# EAGLE design coproDeadEnd (EAGLE 8.4.1)
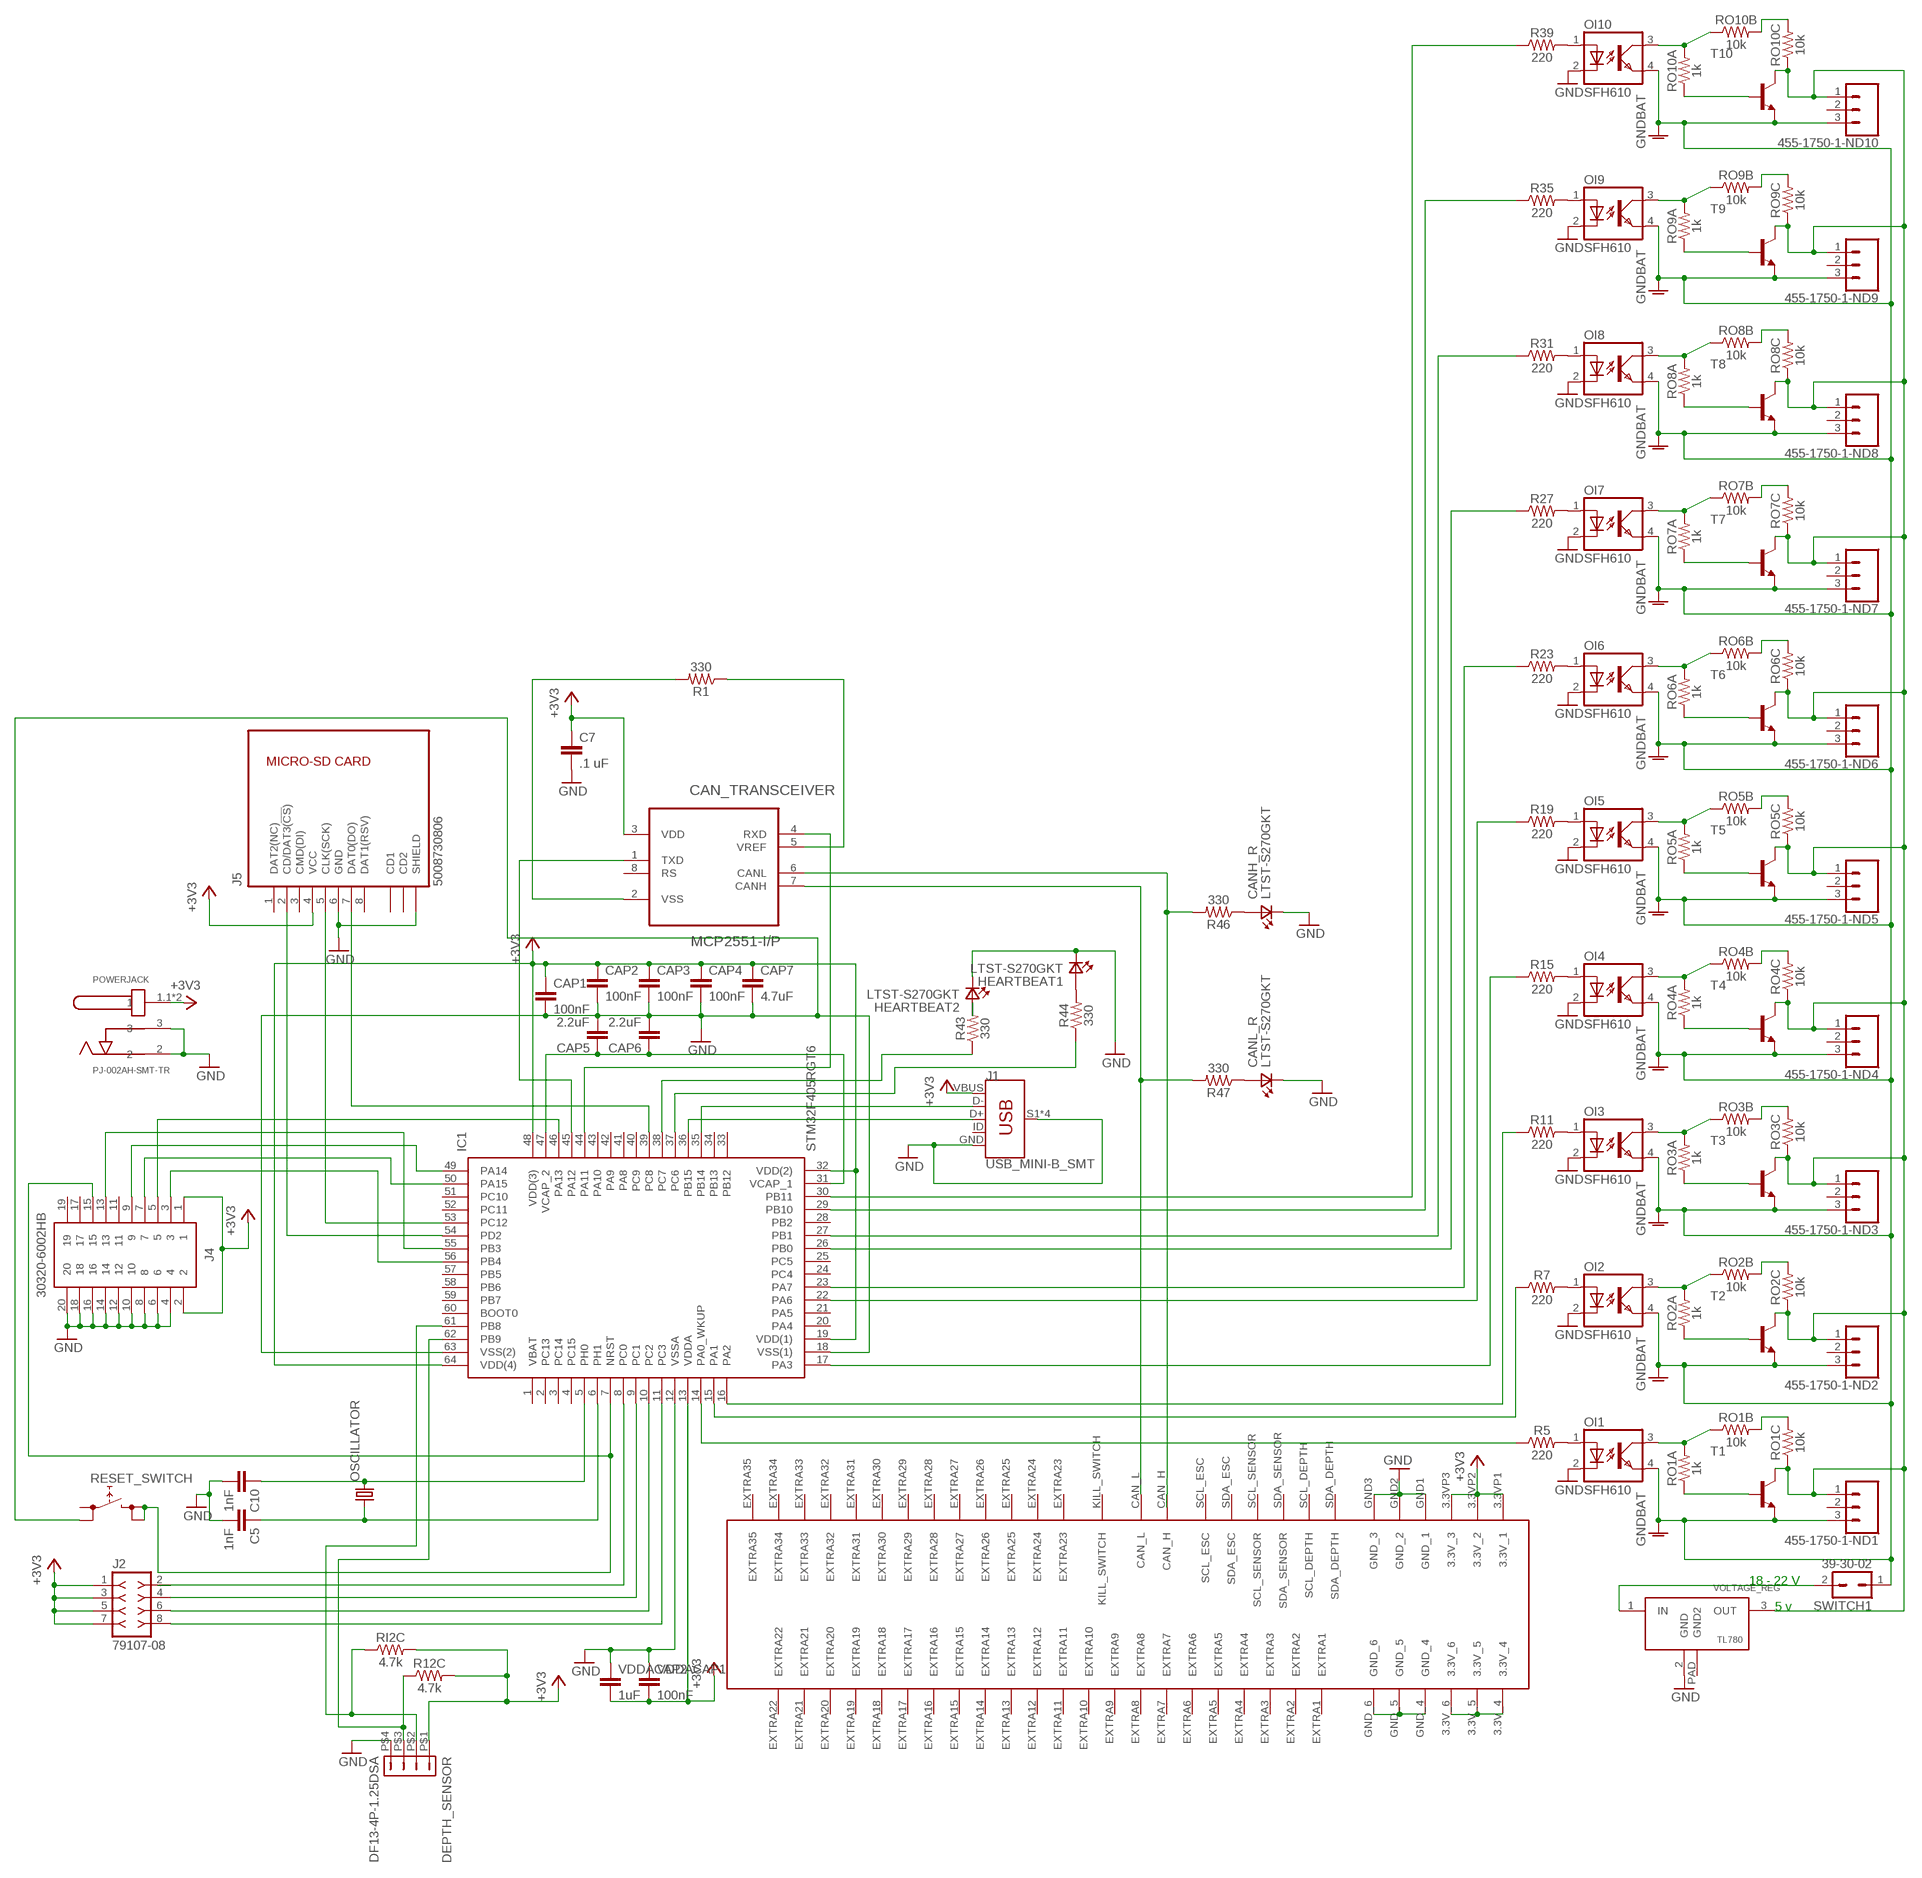
[diagram p0: schematic, sheet 1]

## Parts
455-1750-1-ND1  CONN_03  [1X03]
455-1750-1-ND2  CONN_03  [1X03]
455-1750-1-ND3  CONN_03  [1X03]
455-1750-1-ND4  CONN_03  [1X03]
455-1750-1-ND5  CONN_03  [1X03]
455-1750-1-ND6  CONN_03  [1X03]
455-1750-1-ND7  CONN_03  [1X03]
455-1750-1-ND8  CONN_03  [1X03]
455-1750-1-ND9  CONN_03  [1X03]
455-1750-1-ND10  CONN_03  [1X03]
C5  1nF  0.1UF-0603-100V-10%  [0603]
C7  .1 uF  0.1UF-0603-100V-10%  [0603]
C10  1nF  0.1UF-0603-100V-10%  [0603]
CAN_TRANSCEIVER  MCP2551-I/P  [DIP254P762X432-8]
CANH_R  LTST-S270GKT  [0603]
CANL_R  LTST-S270GKT  [0603]
CAP1  100nF  0.1UF-0603-100V-10%  [0603]
CAP2  100nF  0.1UF-0603-100V-10%  [0603]
CAP3  100nF  0.1UF-0603-100V-10%  [0603]
CAP4  100nF  0.1UF-0603-100V-10%  [0603]
CAP5  2.2uF  0.1UF-0603-100V-10%  [0603]
CAP6  2.2uF  0.1UF-0603-100V-10%  [0603]
CAP7  4.7uF  0.1UF-0603-100V-10%  [0603]
DEPTH_SENSOR  DF13-4P-1.25DSA  [DF13-4P-1.25DSA]
HEARTBEAT1  LTST-S270GKT  [0603]
HEARTBEAT2  LTST-S270GKT  [0603]
IC1  STM32F405RGT6  [QFP50P1200X1200X160-64N]
J1  USB_MINI-B_SMT  [USB-MINIB]
J2  79107-08  [79107-08]
J4  30320-6002HB  [SHDR20W81P254_2X10_3300X840X93]
J5  5008730806  [5008730806]
OI1  SFH610  [DIL04]
OI2  SFH610  [DIL04]
OI3  SFH610  [DIL04]
OI4  SFH610  [DIL04]
OI5  SFH610  [DIL04]
OI6  SFH610  [DIL04]
OI7  SFH610  [DIL04]
OI8  SFH610  [DIL04]
OI9  SFH610  [DIL04]
OI10  SFH610  [DIL04]
OSCILLATOR  CRYSTALHC49S  [HC49/S]
POWERJACK  PJ-002AH-SMT-TR  [CUI_PJ-002AH-SMT-TR]
R1  330  1KOHM-0603-1/10W-1%  [0603]
R5  220  1KOHM-0603-1/10W-1%  [0603]
R7  220  1KOHM-0603-1/10W-1%  [0603]
R11  220  1KOHM-0603-1/10W-1%  [0603]
R12C  4.7k  1KOHM-0603-1/10W-1%  [0603]
R15  220  1KOHM-0603-1/10W-1%  [0603]
R19  220  1KOHM-0603-1/10W-1%  [0603]
R23  220  1KOHM-0603-1/10W-1%  [0603]
R27  220  1KOHM-0603-1/10W-1%  [0603]
R31  220  1KOHM-0603-1/10W-1%  [0603]
R35  220  1KOHM-0603-1/10W-1%  [0603]
R39  220  1KOHM-0603-1/10W-1%  [0603]
R43  330  1KOHM-0603-1/10W-1%  [0603]
R44  330  1KOHM-0603-1/10W-1%  [0603]
R46  330  1KOHM-0603-1/10W-1%  [0603]
R47  330  1KOHM-0603-1/10W-1%  [0603]
RESET_SWITCH  REKN  [REKN]
RI2C  4.7k  1KOHM-0603-1/10W-1%  [0603]
RO1A  1k  1KOHM-0603-1/10W-1%  [0603]
RO1B  10k  1KOHM-0603-1/10W-1%  [0603]
RO1C  10k  1KOHM-0603-1/10W-1%  [0603]
RO2A  1k  1KOHM-0603-1/10W-1%  [0603]
RO2B  10k  1KOHM-0603-1/10W-1%  [0603]
RO2C  10k  1KOHM-0603-1/10W-1%  [0603]
RO3A  1k  1KOHM-0603-1/10W-1%  [0603]
RO3B  10k  1KOHM-0603-1/10W-1%  [0603]
RO3C  10k  1KOHM-0603-1/10W-1%  [0603]
RO4A  1k  1KOHM-0603-1/10W-1%  [0603]
RO4B  10k  1KOHM-0603-1/10W-1%  [0603]
RO4C  10k  1KOHM-0603-1/10W-1%  [0603]
RO5A  1k  1KOHM-0603-1/10W-1%  [0603]
RO5B  10k  1KOHM-0603-1/10W-1%  [0603]
RO5C  10k  1KOHM-0603-1/10W-1%  [0603]
RO6A  1k  1KOHM-0603-1/10W-1%  [0603]
RO6B  10k  1KOHM-0603-1/10W-1%  [0603]
RO6C  10k  1KOHM-0603-1/10W-1%  [0603]
RO7A  1k  1KOHM-0603-1/10W-1%  [0603]
RO7B  10k  1KOHM-0603-1/10W-1%  [0603]
RO7C  10k  1KOHM-0603-1/10W-1%  [0603]
RO8A  1k  1KOHM-0603-1/10W-1%  [0603]
RO8B  10k  1KOHM-0603-1/10W-1%  [0603]
RO8C  10k  1KOHM-0603-1/10W-1%  [0603]
RO9A  1k  1KOHM-0603-1/10W-1%  [0603]
RO9B  10k  1KOHM-0603-1/10W-1%  [0603]
RO9C  10k  1KOHM-0603-1/10W-1%  [0603]
RO10A  1k  1KOHM-0603-1/10W-1%  [0603]
RO10B  10k  1KOHM-0603-1/10W-1%  [0603]
RO10C  10k  1KOHM-0603-1/10W-1%  [0603]
SWITCH1  39-30-02  [39-30-?02?]
T1  -NPN-TO126V  [TO126V]
T2  -NPN-TO126V  [TO126V]
T3  -NPN-TO126V  [TO126V]
T4  -NPN-TO126V  [TO126V]
T5  -NPN-TO126V  [TO126V]
T6  -NPN-TO126V  [TO126V]
T7  -NPN-TO126V  [TO126V]
T8  -NPN-TO126V  [TO126V]
T9  -NPN-TO126V  [TO126V]
T10  -NPN-TO126V  [TO126V]
U$1  5530843  [5530843-6-BOARDFINGERS]
VDDACAP1  100nF  0.1UF-0603-100V-10%  [0603]
VDDACAP2  1uF  0.1UF-0603-100V-10%  [0603]
VOLTAGE_REG  TL780_VREG  [D2PAK-3]

## Nets
2: IC1.8(PC0) J2.2
3.3V: C7.1 CAN_TRANSCEIVER.3(VDD) CAP1.1 CAP2.1 CAP3.1 CAP4.1 CAP7.1 DEPTH_SENSOR.P$1 IC1.13(VDDA) IC1.19(VDD(1)) IC1.32(VDD(2)) IC1.48(VDD(3)) IC1.64(VDD(4)) J1.VBUS J2.1 J2.3 J2.5 J2.7 J4.1 J4.2 J5.4(VCC) POWERJACK.1.1 POWERJACK.1.2 R12C.2 RI2C.2 U$1.3.3VP1(3.3V_1) U$1.3.3VP2(3.3V_2) U$1.3.3VP3(3.3V_3) VDDACAP1.2 VDDACAP2.2 ; supply symbol labelled +3V3
4: IC1.9(PC1) J2.4
6: IC1.10(PC2) J2.6
8: IC1.11(PC3) J2.8
CANH: CAN_TRANSCEIVER.6(CANL) R46.2 U$1.CAN_H
CANL: CAN_TRANSCEIVER.7(CANH) R47.2 U$1.CAN_L
CLK: IC1.53(PC12) J5.5(CLK(SCK))
CMD: IC1.54(PD2) J5.2(CD/DAT3(!CS!))
D+: IC1.36(PB15) J1.D+
D-: IC1.35(PB14) J1.D-
DATO: IC1.39(PC8) J5.7(DAT0(DO))
GND: C5.2 C7.2 C10.2 CANH_R.1(K2) CANL_R.1(K2) CAP1.2 CAP2.2 CAP3.2 CAP4.2 CAP5.2 CAP6.2 CAP7.2 DEPTH_SENSOR.P$4 HEARTBEAT1.1(K2) HEARTBEAT2.1(K2) IC1.12(VSSA) IC1.18(VSS(1)) IC1.63(VSS(2)) J1.GND J1.S1(SHIELD) J1.S2(SHIELD) J1.S3(SHIELD) J1.S4(SHIELD) J4.4 J4.6 J4.8 J4.10 J4.12 J4.14 J4.16 J4.18 J4.20 J5.6(GND) J5.S3(SHIELD) J5.S4(SHIELD) OI1.2(C) OI2.2(C) OI3.2(C) OI4.2(C) OI5.2(C) OI6.2(C) OI7.2(C) OI8.2(C) OI9.2(C) OI10.2(C) POWERJACK.2 POWERJACK.3 RESET_SWITCH.0B U$1.GND1(GND_1) U$1.GND2(GND_2) U$1.GND3(GND_3) U$1.GND_4 U$1.GND_5 U$1.GND_6 VDDACAP1.1 VDDACAP2.1 VOLTAGE_REG.2(GND)
GNDBAT: 455-1750-1-ND1.3 455-1750-1-ND2.3 455-1750-1-ND3.3 455-1750-1-ND4.3 455-1750-1-ND5.3 455-1750-1-ND6.3 455-1750-1-ND7.3 455-1750-1-ND8.3 455-1750-1-ND9.3 455-1750-1-ND10.3 OI1.4(EMIT) OI2.4(EMIT) OI3.4(EMIT) OI4.4(EMIT) OI5.4(EMIT) OI6.4(EMIT) OI7.4(EMIT) OI8.4(EMIT) OI9.4(EMIT) OI10.4(EMIT) SWITCH1.1 T1.1(E) T2.1(E) T3.1(E) T4.1(E) T5.1(E) T6.1(E) T7.1(E) T8.1(E) T9.1(E) T10.1(E)
HEARTBEAT1: IC1.37(PC6) R44.1
HEARTBEAT2: IC1.38(PC7) R43.1
JTAG3: IC1.56(PB4) J4.3
JTAG5: IC1.46(PA13) J4.5
JTAG9: IC1.49(PA14) J4.9
JTAG13: IC1.55(PB3) J4.13
JTAG15: IC1.7(NRST) J4.15 RESET_SWITCH.1A RESET_SWITCH.1B
N$1: OI2.3(COL) RO2A.2 RO2B.1
N$2: RO1A.1 T1.3(B)
N$4: OI1.1(A) R5.2
N$5: CAN_TRANSCEIVER.2(VSS) R1.2
N$6: OI1.3(COL) RO1A.2 RO1B.1
N$7: SWITCH1.2 VOLTAGE_REG.1(IN)
N$8: CANL_R.2(A2) R47.1
N$9: RO2A.1 T2.3(B)
N$10: RO1B.2 RO1C.2
N$11: OI2.1(A) R7.2
N$12: CAN_TRANSCEIVER.5(VREF) R1.1
N$13: IC1.14(PA0_WKUP) R5.1
N$14: HEARTBEAT2.2(A2) R43.2
N$15: RO2B.2 RO2C.2
N$16: OI3.3(COL) RO3A.2 RO3B.1
N$17: RO3A.1 T3.3(B)
N$18: 455-1750-1-ND1.1 455-1750-1-ND2.1 455-1750-1-ND3.1 455-1750-1-ND4.1 455-1750-1-ND5.1 455-1750-1-ND6.1 455-1750-1-ND7.1 455-1750-1-ND8.1 455-1750-1-ND9.1 455-1750-1-ND10.1 RO1C.1 RO2C.1 RO3C.1 RO4C.1 RO5C.1 RO6C.1 RO7C.1 RO8C.1 RO9C.1 RO10C.1 T1.2(C) T2.2(C) T3.2(C) T4.2(C) T5.2(C) T6.2(C) T7.2(C) T8.2(C) T9.2(C) T10.2(C) VOLTAGE_REG.3(OUT)
N$19: OI3.1(A) R11.2
N$22: RO3B.2 RO3C.2
N$23: OI4.3(COL) RO4A.2 RO4B.1
N$24: RO4A.1 T4.3(B)
N$26: OI4.1(A) R15.2
N$28: HEARTBEAT1.2(A2) R44.2
N$29: RO4B.2 RO4C.2
N$30: OI5.3(COL) RO5A.2 RO5B.1
N$31: RO5A.1 T5.3(B)
N$33: OI5.1(A) R19.2
N$34: CANH_R.2(A2) R46.1
N$36: RO5B.2 RO5C.2
N$37: OI6.3(COL) RO6A.2 RO6B.1
N$38: RO6A.1 T6.3(B)
N$40: OI6.1(A) R23.2
N$43: RO6B.2 RO6C.2
N$44: OI7.3(COL) RO7A.2 RO7B.1
N$45: RO7A.1 T7.3(B)
N$47: OI7.1(A) R27.2
N$50: RO7B.2 RO7C.2
N$51: OI8.3(COL) RO8A.2 RO8B.1
N$52: RO8A.1 T8.3(B)
N$54: OI8.1(A) R31.2
N$57: RO8B.2 RO8C.2
N$58: OI9.3(COL) RO9A.2 RO9B.1
N$59: RO9A.1 T9.3(B)
N$61: OI9.1(A) R35.2
N$64: RO9B.2 RO9C.2
N$65: OI10.3(COL) RO10A.2 RO10B.1
N$66: RO10A.1 T10.3(B)
N$68: OI10.1(A) R39.2
N$71: RO10B.2 RO10C.2
OI2: IC1.15(PA1) R7.1
OI3: IC1.16(PA2) R11.1
OI4: IC1.17(PA3) R15.1
OI5: IC1.22(PA6) R19.1
OI6: IC1.23(PA7) R23.1
OI7: IC1.26(PB0) R27.1
OI8: IC1.27(PB1) R31.1
OI10: IC1.30(PB11) R39.1
OIO9: IC1.29(PB10) R35.1
OSC1: C5.1 IC1.6(PH1) OSCILLATOR.1
OSC2: C10.1 IC1.5(PH0) OSCILLATOR.2
P$2: DEPTH_SENSOR.P$2 IC1.61(PB8) RI2C.1
PA15: IC1.50(PA15) J4.7
POWER: U$1.3.3V_4 U$1.3.3V_5 U$1.3.3V_6
PS$3: DEPTH_SENSOR.P$3 IC1.62(PB9) R12C.1
RXD: CAN_TRANSCEIVER.4(RXD) IC1.44(PA11)
TXD: CAN_TRANSCEIVER.1(TXD) IC1.45(PA12)
VCAP_2TO1: CAP5.1 CAP6.1 IC1.31(VCAP_1) IC1.47(VCAP_2)
Unconnected: 455-1750-1-ND1.2 455-1750-1-ND2.2 455-1750-1-ND3.2 455-1750-1-ND4.2 455-1750-1-ND5.2 455-1750-1-ND6.2 455-1750-1-ND7.2 455-1750-1-ND8.2 455-1750-1-ND9.2 455-1750-1-ND10.2 CAN_TRANSCEIVER.8(RS) IC1.1(VBAT) IC1.2(PC13) IC1.3(PC14) IC1.4(PC15) IC1.20(PA4) IC1.21(PA5) IC1.24(PC4) IC1.25(PC5) IC1.28(PB2) IC1.33(PB12) IC1.34(PB13) IC1.40(PC9) IC1.41(PA8) IC1.42(PA9) IC1.43(PA10) IC1.51(PC10) IC1.52(PC11) IC1.57(PB5) IC1.58(PB6) IC1.59(PB7) IC1.60(BOOT0) J1.ID J4.11 J4.17 J4.19 J5.1(DAT2(NC)) J5.3(CMD(DI)) J5.8(DAT1(RSV)) J5.CD1 J5.CD2 RESET_SWITCH.0A U$1.EXTRA1 U$1.EXTRA2 U$1.EXTRA3 U$1.EXTRA4 U$1.EXTRA5 U$1.EXTRA6 U$1.EXTRA7 U$1.EXTRA8 U$1.EXTRA9 U$1.EXTRA10 U$1.EXTRA11 U$1.EXTRA12 U$1.EXTRA13 U$1.EXTRA14 U$1.EXTRA15 U$1.EXTRA16 U$1.EXTRA17 U$1.EXTRA18 U$1.EXTRA19 U$1.EXTRA20 U$1.EXTRA21 U$1.EXTRA22 U$1.EXTRA23 U$1.EXTRA24 U$1.EXTRA25 U$1.EXTRA26 U$1.EXTRA27 U$1.EXTRA28 U$1.EXTRA29 U$1.EXTRA30 U$1.EXTRA31 U$1.EXTRA32 U$1.EXTRA33 U$1.EXTRA34 U$1.EXTRA35 U$1.KILL_SWITCH U$1.SCL_DEPTH U$1.SCL_ESC U$1.SCL_SENSOR U$1.SDA_DEPTH U$1.SDA_ESC U$1.SDA_SENSOR VOLTAGE_REG.PAD(GND2)

## Notes on the sheet
- 18 - 22 V
- 5 v

## Library data of the parts
455-1750-1-ND1-455-1750-1-ND10 = SparkFun-Connectors:CONN_03: Multi connection point. Often used as Generic Header-pin footprint for 0.1 inch spaced/style header connections On any of the 0.1 inch spaced packages, you can populate with these: Break Away Headers - Straight <https://www.sparkfun.com/products/116> (PRT-00116) Break Away Male Headers - Right Angle <https://www.sparkfun.com/products/553> (PRT-00553) Female Headers <https://www.sparkfun.com/products/115> (PRT-00115) Break Away Headers - Machine Pin <https://www.sparkfun.com/products/117> (PRT-00117) Break Away Female Headers - Swiss Machine Pin <https://www.sparkfun.com/products/743> (PRT-00743) Stackable Header - 3 Pin (Female, 0.1") <https://www.sparkfun.com/products/13875> (PRT-13875) For SCREWTERMINALS and SPRING TERMINALS visit here: Screw Terimnals on SparkFun.com <https://www.sparkfun.com/search/results?term=Screw+Terminals> (5mm/3.5mm/2.54mm spacing) This device is also useful as a general connection point to wire up your design to another part of your project. Our various solder wires solder well into these plated through hole pads. Hook-Up Wire - Assortment (Stranded, 22 AWG) <https://www.sparkfun.com/products/11375> (PRT-11375) Hook-Up Wire - Assortment (Solid Core, 22 AWG) <https://www.sparkfun.com/products/11367> (PRT-11367) View the entire wire category on our website here <https://www.sparkfun.com/categories/141> Special notes: Molex polarized connector foot print use with SKU : PRT-08232 with associated crimp pins and housings.; PROD_ID: XXX-00000; VALUE: 455-1750-1-ND
C5 C7 C10 CAP1-CAP7 VDDACAP1 VDDACAP2 = SparkFun-Capacitors:0.1UF: 0.1µF ceramic capacitors A capacitor is a passive two-terminal electrical component used to store electrical energy temporarily in an electric field.; PROD_ID: CAP-08390; VALUE: 0.1uF
CAN_TRANSCEIVER = MCP2551-I_P:MCP2551-I/P: High-Speed CAN Transceiver; DESCRIPTION: MCP2551 Series 5.5 V 1 Mb/s Surface Mount High-Speed CAN Transceiver - PDIP-8; DIGI-KEY_PART_NUMBER: MCP2551-I/P-ND; DIGI-KEY_PURCHASE_URL: https://www.digikey.com/product-detail/en/microchip-technology/MCP2551-I-P/MCP2551-I-P-ND/509453?WT.z_cid=ref_snapeda; MF: Microchip; MP: MCP2551-I/P; PACKAGE: DIP-8 Microchip
CANH_R CANL_R HEARTBEAT1 HEARTBEAT2 = LTST-S270GKT:LTST-S270GKT: https://octopart.com/ltst-c190gkt-lite-on-549821; AVAILABILITY: Good; DESCRIPTION: Green 1.6 x 0.6 x 1.15 mm 130° Water Clear 12 mcd 2.1 V Molded SMT LED; MF: Lite-On; MP: LTST-S270GKT; PACKAGE: 0603 Lite-On; PRICE: 0.08 USD
DEPTH_SENSOR = con-hirose-df13:DF13-4P-1.25: DF13-4P 1.25mm Pitch Miniature Crimping Connector.
IC1 = STM32F405RGT6:STM32F405RGT6: MCU 32-Bit, ARM Cortex M4, 1MB Flash STMicroelectronics STM32F405RGT6, 32bit ARM Cortex M4F Microcontroller, 168MHz, 1024 kB Flash, 64-Pin LQFP <https://componentsearchengine.com/Images/3/STM32F405RGT6.jpg> Source: Datasheet <http://www.st.com/web/en/resource/technical/document/datasheet/DM00037051.pdf>; ALLIED_NUMBER: 70391099; DESCRIPTION: MCU 32-Bit, ARM Cortex M4, 1MB Flash STMicroelectronics STM32F405RGT6, 32bit ARM Cortex M4F Microcontroller, 168MHz, 1024 kB Flash, 64-Pin LQFP; HEIGHT: 1.6mm; MANUFACTURER_NAME: STMicroelectronics; MANUFACTURER_PART_NUMBER: STM32F405RGT6; RS_PART_NUMBER: 7468217; SUPPLIER_NAME: RS
J1 = SparkFun-Connectors:USB_MINI-B: USB type Mini-B Connector Breaks out 5th pin, and includes shield pins if needed. SparkFun Products: SparkFun FTDI Basic Breakout <https://www.sparkfun.com/products/9716> SparkFun XBee Explorer USB <https://www.sparkfun.com/products/11812> SparkFun Redboard <https://www.sparkfun.com/products/12757>; PROD_ID: CONN-08193; SF_ID: PRT-00587
J2 = con-molex-milli-grid:79107-08: RECEPTACAL
J4 = 30320-6002HB:30320-6002HB: Header 20 position 3M 303 Series, 2.54mm Pitch 20 Way 2 Row Shrouded Straight PCB Header, Through Hole, Solder Termination <https://componentsearchengine.com/Images/3/30320-6002HB.jpg> Source: Datasheet <http://multimedia.3m.com/mws/media/22504O/3mtm-100-in-loprof-hdr-100x-100strt-ra-4-wall-ts0818.pdf>; DESCRIPTION: Header 20 position 3M 303 Series, 2.54mm Pitch 20 Way 2 Row Shrouded Straight PCB Header, Through Hole, Solder Termination; HEIGHT: 9.3mm; MANUFACTURER_NAME: 3M; MANUFACTURER_PART_NUMBER: 30320-6002HB; RS_PART_NUMBER: 8273587; SUPPLIER_NAME: RS
J5 = 5008730806:5008730806: micro SD Card Connector Molex; AVAILABILITY: Good; DESCRIPTION: Connector: for cards; SD Micro; push-push; SMT; gold plated; PIN: 8; MF: Molex; MP: 500873-0806; PACKAGE: None; PRICE: 2.47 USD
OI1-OI10 = optocoupler:SFH610: SIEMENS OPTO COUPLER; MF: VISHAY/TELEFUNKEN; MPN: SFH6106-4; OC_FARNELL: 1469568; OC_NEWARK: 58K2193
OSCILLATOR = crystal:CRYSTAL: CRYSTAL; OC_FARNELL: 1667008; OC_NEWARK: unknown
POWERJACK = PJ-002AH-SMT-TR:PJ-002AH-SMT-TR: PJ-002 Series 2 x 6.5 mm 24 V Right Angle SMT Power Jack; AVAILABILITY: Good; DESCRIPTION: 24 VDC 5 A Surface Mount Unshielded 2 Conductors 3 Contacts Male Power Jack; MF: CUI; MP: PJ-002AH-SMT-TR; PACKAGE: None; PRICE: 0.98 USD
R1 R5 R7 R11 R12C R15 R19 R23 R27 R31 R35 R39 R43 R44 R46 R47 RI2C RO1B RO1C RO2B RO2C RO3B RO3C RO4B RO4C RO5B RO5C RO6B RO6C RO7B RO7C RO8B RO8C RO9B RO9C RO10B RO10C = SparkFun-Resistors:1KOHM: 1kΩ resistor A resistor is a passive two-terminal electrical component that implements electrical resistance as a circuit element. Resistors act to reduce current flow, and, at the same time, act to lower voltage levels within circuits. - Wikipedia; PROD_ID: RES-07856; VALUE: 1k
RESET_SWITCH = switch:REKN: PUSH SWITCH ITT-Cannon-Cannon
RO1A RO2A RO3A RO4A RO5A RO6A RO7A RO8A RO9A RO10A = SparkFun-Resistors:1KOHM: 1kΩ resistor A resistor is a passive two-terminal electrical component that implements electrical resistance as a circuit element. Resistors act to reduce current flow, and, at the same time, act to lower voltage levels within circuits. - Wikipedia; PROD_ID: RES-07856
SWITCH1 = con-molex-mini-fit:39-30-?02?: HEADER
T1-T10 = transistor:*-NPN-: NPN Transistror BF959 corrected 2008.03.06
U$1 = 5530843-6:5530843
VOLTAGE_REG = TL780_VREG:TL780_VREG; AVAILABILITY: Good; DESCRIPTION: 3 Pin 1.5A Fixed 5V Positive Voltage Regulator 3-TO-220 0 to 125; MF: Texas Instruments; MP: TL780-05KCSE3; PACKAGE: TO-220 Texas Instruments; PRICE: 0.44 USD

## Board
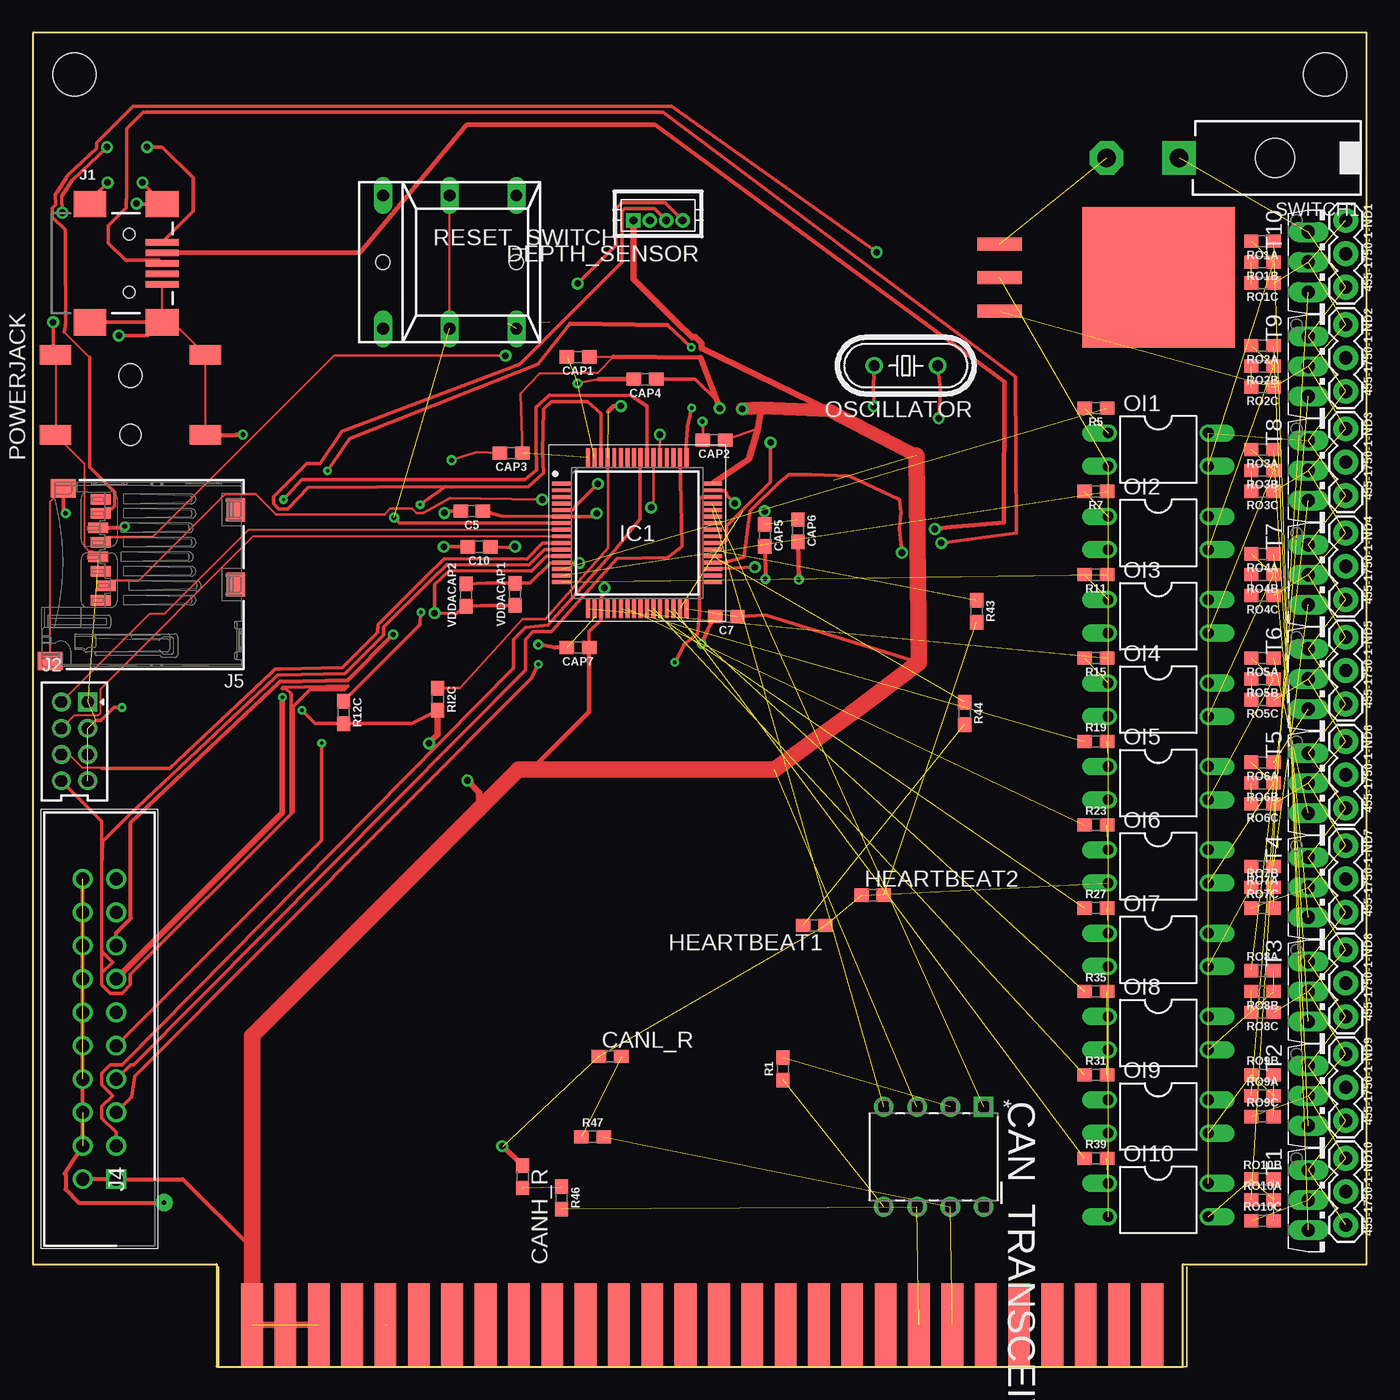
[diagram p1: board, top side]
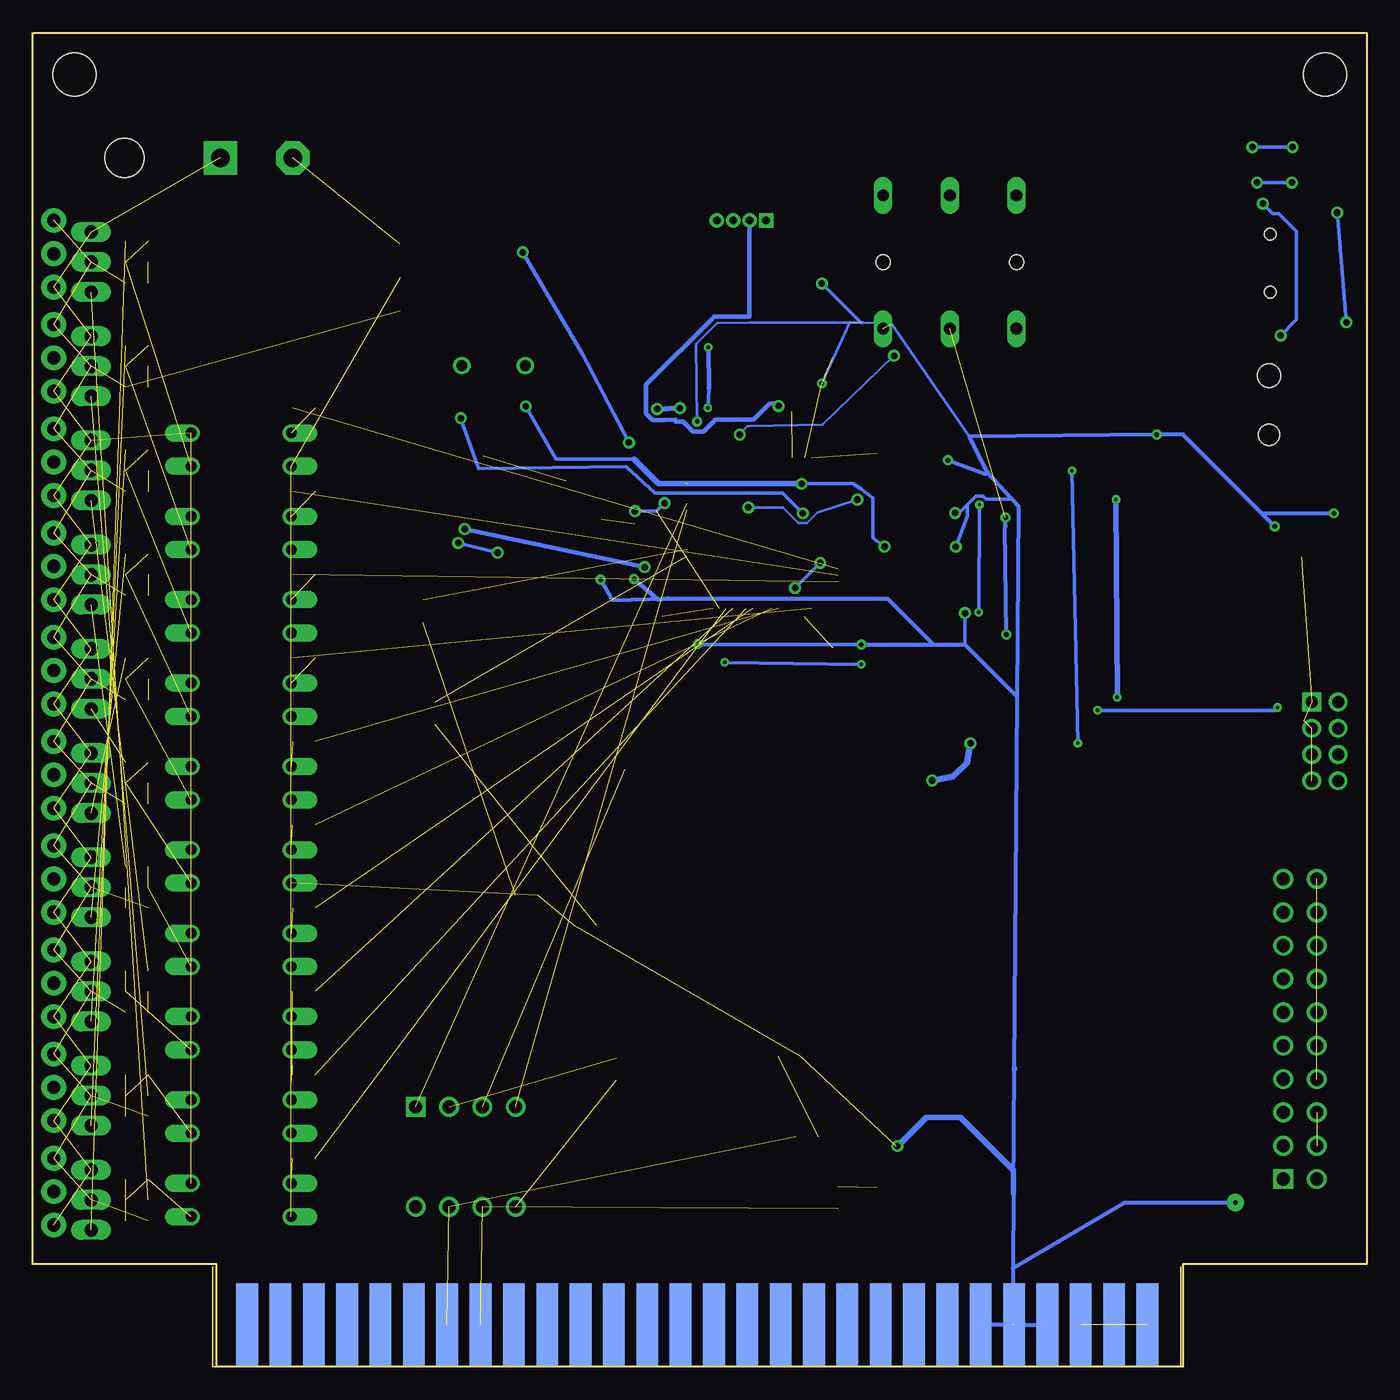
[diagram p2: board, bottom side, seen from below]

Size 101.6 x 101.6 mm. Coordinates in mm from the lower left corner, seen from the top.
Outline: 14,0 87.6,0 87.6,7.8 101.6,7.8 101.6,101.6 0,101.6 0,7.8 14,7.8 14,0
Copper layers (1*16): Top 0.035mm / dielectric 1.5mm / Bottom 0.035mm
Design rules "battery_balancer": minimum track width 6mil, minimum drill 0.35mm, track to track 0.205mm, track to pad 0.205mm, pad to pad 0.205mm, via to via 0.205mm, smd to smd 6mil, copper to edge 40mil, drill to drill 6mil, minimum pad ring 10mil, minimum via ring 8mil, stop-mask expansion 4mil, vias tented up to drill 0mil, thermal gap 10mil
Holes 3.26 mm at 3.17,98.42 98.42,98.42

### Footprints (pad centres in the part's own frame; a part is rotated, then mirrored left to right if it is on the bottom)
1X03 = drill 1.016 pad 1.88: 1 0,0; 2 2.54,0; 3 5.08,0
0603 = smd 1.1 x 1: 1 -0.85,0; 2 0.85,0
DIP254P762X432-8 = drill 0.991 square: 1 -7.62,7.62 | drill 0.991: 2 -7.62,5.08; 3 -7.62,2.54; 4 -7.62,0; 5 0,0; 6 0,2.54; 7 0,5.08; 8 0,7.62
DF13-4P-1.25DSA = drill 0.6 pad 1.016 square: P$1 1.875,0 | drill 0.6 pad 1.016: P$2 0.625,0; P$3 -0.625,0; P$4 -1.875,0
QFP50P1200X1200X160-64N = smd 1.45 x 0.3: 1 -5.75,3.75; 2 -5.75,3.25; 3 -5.75,2.75; 4 -5.75,2.25; 5 -5.75,1.75; 6 -5.75,1.25; 7 -5.75,0.75; 8 -5.75,0.25; 9 -5.75,-0.25; 10 -5.75,-0.75; 11 -5.75,-1.25; 12 -5.75,-1.75; 13 -5.75,-2.25; 14 -5.75,-2.75; 15 -5.75,-3.25; 16 -5.75,-3.75; 33 5.75,-3.75; 34 5.75,-3.25; 35 5.75,-2.75; 36 5.75,-2.25; 37 5.75,-1.75; 38 5.75,-1.25; 39 5.75,-0.75; 40 5.75,-0.25; 41 5.75,0.25; 42 5.75,0.75; 43 5.75,1.25; 44 5.75,1.75; 45 5.75,2.25; 46 5.75,2.75; 47 5.75,3.25; 48 5.75,3.75 | smd 0.3 x 1.45: 17 -3.75,-5.75; 18 -3.25,-5.75; 19 -2.75,-5.75; 20 -2.25,-5.75; 21 -1.75,-5.75; 22 -1.25,-5.75; 23 -0.75,-5.75; 24 -0.25,-5.75; 25 0.25,-5.75; 26 0.75,-5.75; 27 1.25,-5.75; 28 1.75,-5.75; 29 2.25,-5.75; 30 2.75,-5.75; 31 3.25,-5.75; 32 3.75,-5.75; 49 3.75,5.75; 50 3.25,5.75; 51 2.75,5.75; 52 2.25,5.75; 53 1.75,5.75; 54 1.25,5.75; 55 0.75,5.75; 56 0.25,5.75; 57 -0.25,5.75; 58 -0.75,5.75; 59 -1.25,5.75; 60 -1.75,5.75; 61 -2.25,5.75; 62 -2.75,5.75; 63 -3.25,5.75; 64 -3.75,5.75
USB-MINIB = smd 2.5 x 0.5: D+ 2.5,0; D- 2.5,0.8; GND 2.5,-1.6; ID 2.5,-0.8; VBUS 2.5,1.6 | smd 2.5 x 2: S1 -3,4.5; S2 2.5,4.5; S3 -3,-4.5; S4 2.5,-4.5 | hole 0.9: 0,2.2; 0,-2.2
79107-08 = drill 0.914 square: 1 -3,1 | drill 0.914: 2 -3,-1; 3 -1,1; 4 -1,-1; 5 1,1; 6 1,-1; 7 3,1; 8 3,-1
SHDR20W81P254_2X10_3300X840X93 = drill 1 pad 1.5 square: 1 0,0 | drill 1 pad 1.5: 2 0,2.54; 3 2.54,0; 4 2.54,2.54; 5 5.08,0; 6 5.08,2.54; 7 7.62,0; 8 7.62,2.54; 9 10.16,0; 10 10.16,2.54; 11 12.7,0; 12 12.7,2.54; 13 15.24,0; 14 15.24,2.54; 15 17.78,0; 16 17.78,2.54; 17 20.32,0; 18 20.32,2.54; 19 22.86,0; 20 22.86,2.54
5008730806 = smd 0.8 x 1.5: 1 -1.94,10.7; 2 -0.84,10.3; 3 0.26,10.7; 4 1.36,10.9; 5 2.46,10.7; 6 3.56,10.9; 7 4.66,10.7; 8 5.76,10.7 | smd 1.8 x 1.4: CD1 -0.75,0.4; CD2 4.95,0.4 | smd 1.4 x 1.9: S3 -6.575,14.55; S4 6.575,13.55
DIL04 = drill 0.813 offset: 1 -1.27,-3.81; 2 1.27,-3.81; 3 1.27,3.81; 4 -1.27,3.81
HC49/S = drill 0.813: 1 -2.413,0; 2 2.413,0
CUI_PJ-002AH-SMT-TR = smd 1.5 x 2.4: 1.1 -3.05,5.7; 1.2 3.05,5.7; 2 -3.05,-5.7; 3 3.05,-5.7 | hole 1.6: -3.05,0 | hole 1.8: 1.45,0
REKN = drill 0.9 long: 0A 5.08,5.08; 0B 5.08,-5.08; 1A 0,5.08; 1B 0,-5.08; A -5.08,5.08; B -5.08,-5.08 | hole 1.1: -5.08,0; 5.08,0
39-30-?02? = drill 1.422 pad 2.54 square: 1 0,0 | drill 1.422 pad 2.54 octagon: 2 0,5.512 | hole 3: 0,-7.3
TO126V = drill 1.016 long: 1 -2.286,-1.27; 2 0,-1.27; 3 2.286,-1.27
5530843-6-BOARDFINGERS = smd 1.651 x 6.35 bottom: 3.3V_4 0.826,3.175; 3.3V_5 3.365,3.175; 3.3V_6 5.905,3.175; EXTRA1 16.066,3.175; EXTRA2 18.605,3.175; EXTRA3 21.145,3.175; EXTRA4 23.686,3.175; EXTRA5 26.226,3.175; EXTRA6 28.765,3.175; EXTRA7 31.305,3.175; EXTRA8 33.846,3.175; EXTRA9 36.386,3.175; EXTRA10 38.925,3.175; EXTRA11 41.465,3.175; EXTRA12 44.005,3.175; EXTRA13 46.545,3.175; EXTRA14 49.086,3.175; EXTRA15 51.626,3.175; EXTRA16 54.166,3.175; EXTRA17 56.706,3.175; EXTRA18 59.245,3.175; EXTRA19 61.785,3.175; EXTRA20 64.326,3.175; EXTRA21 66.865,3.175; EXTRA22 69.406,3.175; GND_4 8.445,3.175; GND_5 10.986,3.175; GND_6 13.525,3.175 | smd 1.651 x 6.35: 3.3VP1 0.826,3.175; 3.3VP2 3.365,3.175; 3.3VP3 5.905,3.175; CAN_H 51.626,3.175; CAN_L 54.166,3.175; EXTRA23 16.066,3.175; EXTRA24 18.605,3.175; EXTRA25 21.145,3.175; EXTRA26 23.686,3.175; EXTRA27 26.226,3.175; EXTRA28 28.765,3.175; EXTRA29 31.305,3.175; EXTRA30 33.846,3.175; EXTRA31 36.386,3.175; EXTRA32 38.925,3.175; EXTRA33 41.465,3.175; EXTRA34 44.005,3.175; EXTRA35 46.545,3.175; GND1 8.445,3.175; GND2 10.986,3.175; GND3 13.525,3.175; KILL_SWITCH 49.086,3.175; SCL_DEPTH 59.245,3.175; SCL_ESC 69.406,3.175; SCL_SENSOR 64.326,3.175; SDA_DEPTH 56.706,3.175; SDA_ESC 66.865,3.175; SDA_SENSOR 61.785,3.175
D2PAK-3 = smd 1 x 3.4: 1 -2.55,-10.6; 2 0,-10.6; 3 2.55,-10.6 | smd 10.7 x 11.6: PAD 0,1.5

### Placement (x,y rotation side)
455-1750-1-ND1  100.01,87.31 270 top
455-1750-1-ND2  100.01,79.38 270 top
455-1750-1-ND3  100.01,71.44 270 top
455-1750-1-ND4  100.01,63.5 270 top
455-1750-1-ND5  100.01,55.56 270 top
455-1750-1-ND6  100.01,47.62 270 top
455-1750-1-ND7  100.01,39.69 270 top
455-1750-1-ND8  100.01,31.75 270 top
455-1750-1-ND9  100.01,23.81 270 top
455-1750-1-ND10  100.01,15.88 270 top
C5  33.44,65.17 180 top
C7  52.83,57.15 180 top
C10  33.99,62.45 180 top
CAN_TRANSCEIVER  64.81,12.18 270 top
CANH_R  37.31,14.47 270 top
CANL_R  43.98,23.64 0 top
CAP1  41.52,76.91 180 top
CAP2  51.89,70.59 180 top
CAP3  36.44,69.6 180 top
CAP4  46.64,75.21 180 top
CAP5  55.75,63.33 270 top
CAP6  58.27,63.67 270 top
CAP7  41.52,54.77 180 top
DEPTH_SENSOR  47.62,87.31 180 top
HEARTBEAT1  59.52,33.61 180 top
HEARTBEAT2  63.98,35.91 0 top
IC1  46.04,63.5 0 top
J1  7.35,84.05 0 top
J2  3.17,47.62 270 top
J4  6.35,14.29 90 top
J5  15.88,60.33 90 top
OI1  85.72,69.85 270 top
OI2  85.72,63.5 270 top
OI3  85.72,57.15 270 top
OI4  85.72,50.8 270 top
OI5  85.72,44.45 270 top
OI6  85.72,38.1 270 top
OI7  85.72,31.75 270 top
OI8  85.72,25.4 270 top
OI9  85.72,19.05 270 top
OI10  85.72,12.7 270 top
OSCILLATOR  66.5,76.25 180 top
POWERJACK  7.44,74.03 90 top
R1  57.15,22.69 90 top
R5  80.96,73.03 180 top
R7  80.96,66.67 180 top
R11  80.96,60.33 180 top
R12C  23.66,49.84 270 top
R15  80.96,53.98 180 top
R19  80.96,47.62 0 top
R23  80.96,41.27 0 top
R27  80.96,34.92 0 top
R31  80.96,22.23 0 top
R35  80.96,28.57 0 top
R39  80.96,15.88 0 top
R43  71.89,57.54 270 top
R44  70.97,49.76 270 top
R46  40.27,12.86 270 top
R47  42.64,17.51 0 top
RESET_SWITCH  31.75,84.14 0 top
RI2C  30.84,50.84 270 top
RO1A  93.66,85.72 180 top
RO1B  93.66,84.14 180 top
RO1C  93.66,82.55 180 top
RO2A  93.66,77.79 180 top
RO2B  93.66,76.2 180 top
RO2C  93.66,74.61 180 top
RO3A  93.66,69.85 180 top
RO3B  93.66,68.26 180 top
RO3C  93.66,66.67 180 top
RO4A  93.66,61.91 180 top
RO4B  93.66,60.33 180 top
RO4C  93.66,58.74 180 top
RO5A  93.66,53.98 180 top
RO5B  93.66,52.39 180 top
RO5C  93.66,50.8 180 top
RO6A  93.66,46.04 180 top
RO6B  93.66,44.45 180 top
RO6C  93.66,42.86 180 top
RO7A  93.66,38.1 180 top
RO7B  93.66,36.51 0 top
RO7C  93.66,34.92 0 top
RO8A  93.66,30.16 0 top
RO8B  93.66,28.57 180 top
RO8C  93.66,26.99 180 top
RO9A  93.66,20.64 0 top
RO9B  93.66,22.23 0 top
RO9C  93.66,19.05 0 top
RO10A  93.66,12.7 0 top
RO10B  93.66,14.29 0 top
RO10C  93.66,11.11 0 top
SWITCH1  39-30-02?  [39-30-?02?]  87.31,92.08 90 top
T1  98.42,12.7 270 top
T2  98.42,20.64 270 top
T3  98.42,28.57 270 top
T4  98.42,36.51 270 top
T5  98.42,44.45 270 top
T6  98.42,52.39 270 top
T7  98.42,60.33 270 top
T8  98.42,68.26 270 top
T9  98.42,76.2 270 top
T10  98.42,84.14 270 top
U$1  15.88,0 0 top
VDDACAP1  36.74,58.84 90 top
VDDACAP2  33,58.77 90 top
VOLTAGE_REG  84.24,82.96 270 top

### Tracks (layer width: path | path; a pad name or v marks a point on that pad's centre or on a via)
2
  Top 0.15: J2.2 8.9,57.35 10.05,57.35 16.45,63.75 IC1.8
3.3V  (via drill 0.25, 0.5)  (10 unrouted)
  Top 0.15: J5.4 4.55,62.1 4.31,62.1 3.94,62.47 3.94,68.77 POWERJACK.1.1 1.74,77.05 POWERJACK.1.2
  Top 0.203: 55.25,71.44 CAP2.1 | CAP1.1 44.24,76.95 43.05,75.7 38.6,75.66 37.17,74.11 CAP3.1
  Top 0.25: 4.78,49.23 5.17,49.23 6.15,50.21 v6.79,50.21 | v20.5,50 21.51,48.99 R12C.2 28.84,48.99 RI2C.2 | CAP4.1 50.45,75.21 52.09,73.57 | v5.65,92.9 2.99,90.39 2.19,89.14 v2.25,87.9 | v8.7,92.9 9.85,92.9 12.2,90.55 12.2,88 J1.VBUS | C7.1 55.8,57.25 67.5,53.65 | v1.54,79.55 1.54,77.24 1.74,77.05 | CAP7.1 42.38,56 43.27,56.89 43.27,57.73 IC1.19 43.31,57.77 43.31,58.61 43.54,58.85 v43.54,59.32 | VDDACAP2.2 34.54,59.69 VDDACAP1.2 37.88,59.69 39.43,61.23 40.27,61.23 IC1.13 40.31,61.23 41.15,61.23 41.16,61.22 v41.62,61.22
  Top 0.305: J4.2 J4.1 11.41,14.29 16.7,9
  Top 0.35: 38,45.5 42.38,49.88 CAP7.1 | 50.85,76.85 44.24,76.95
  Top 0.4: v52.31,73 52.09,73.57 50.85,76.85
  Top 0.5: 51.89,67.36 54.55,69.11 55.25,71.44 55.3,72 55.5,73 | RI2C.2 30.84,48.15 v30.17,47.48 | v33.1,44.65 34,43.75 34,42.5 | 60.8,72.8 50.93,77.57 50.93,77.97 50.47,78.43 50.22,78.43 48.98,79.59 48.61,79.97 45.75,82.83 DEPTH_SENSOR.P$1
  Top 0.508: U$1.3.3VP1 U$1.3.3VP2 U$1.3.3VP3
  Top 1: 67.3,69.4 60.8,72.8 55.5,73 v54.05,72.95
  Top 1.27: U$1.3.3VP1 16.7,9 16.7,25.2 34,42.5 37,45.5 38,45.5 56.5,45.5 62.35,49.75 67.5,53.65 67.3,69.4
  Bottom 0.25: v6.79,50.21 7,50 v20.5,50 | v5.65,92.9 v8.7,92.9 | v2.25,87.9 v1.54,79.55 | v43.54,59.32 41.64,61.22 v41.62,61.22
  Bottom 0.4: v54.05,72.95 v52.31,73
  Bottom 0.5: v30.17,47.48 30.45,46 31.5,44.95 33,44.65 v33.1,44.65
4
  Top 0.15: IC1.9 16.8,63.25 5.17,51.62 5.17,49.8 5,49.63 3.18,49.63 J2.4
6
  Top 0.16: J2.6 2.77,46.62 3.76,45.63 5.17,45.63 5.25,45.55
  Top 0.25: 5.25,45.55 10.43,45.55 18.19,52.87 18.38,53.06 18.44,53.13 | 18.44,53.13 | 18.44,53.13 | 18.44,53.13 18.47,53.13 18.49,53.15 | 18.49,53.15 | 18.49,53.15 18.51,53.15 18.85,53.14 23.6,53.24 26.27,55.93 26.28,56.07 26.28,56.25 26.28,56.26 26.28,56.33 26.28,56.51 26.29,56.52 26.42,56.65 29.72,59.95 29.72,59.96 | 29.72,59.96 | 29.72,59.96 | 31.37,61.54 31.25,61.43 31.1,61.28 30.25,60.47 30.24,60.47 29.99,60.22 29.72,59.96 | 31.37,61.54 | 31.37,61.54 | 31.37,61.54 31.37,61.55 31.38,61.55 37.63,61.52 38.84,62.73 40.27,62.73 IC1.10
8
  Top 0.25: 5.27,29.08 5.9,28.44 | 5.9,28.44 6.8,28.44 | 6.8,28.44 7.43,29.08 | 7.43,29.08 7.43,29.86 | 7.43,29.86 19.22,41.65 | 19.22,41.65 7.43,29.86 | 7.43,29.86 7.43,29.08 | 7.43,29.08 6.8,28.44 | 6.8,28.44 5.9,28.44 | 5.9,28.44 5.27,29.08 | 5.27,29.08 5.27,29.98 | IC1.11 40.27,62.23 38.99,62.23 37.82,61.06 31.56,61.09 31.55,61.09 31.42,60.96 30.44,60.02 30.43,60.02 30.3,59.89 30.17,59.76 30.17,59.75 26.74,56.32 26.73,56.06 26.73,55.74 23.8,52.79 18.85,52.68 18.66,52.69 18.65,52.68 18.64,52.68 18.51,52.54 7.27,41.94 7.26,41.94 7.12,41.81 6.99,41.67 5.32,40 5.27,38.12 5.27,31.62 6.09,30.8 5.27,29.98 | 19.22,41.65 19.66,42.09 19.66,51.27 19.27,51.66 18.98,51.66 19.05,51.72 24.01,51.83 23.75,51.57 21.14,51.57 19.84,50.27 19.84,42.27 19.22,41.65 | J2.8 5.27,41.53 5.27,29.98 | 5.27,29.98 5.27,29.08
CANH  (2 unrouted)
CANL  (2 unrouted)
CLK  (via drill 0.5)
  Top 0.2: J5.5 5.57,63.18 9.15,63.18 22.97,77 v36,77 | IC1.53 47.74,69.3 47.74,70.1 47.76,70.34 v47.76,71
  Bottom 0.2: v36,77 41.45,71.75 47.05,71.65 47.15,71.65 v47.76,71
CMD  (via drill 0.5)
  Top 0.2: J5.2 5.97,59.88 8.05,59.88 14.65,66.48 16.98,66.48 18.55,64.91 26.78,64.91 27.23,65.36 28.9,65.36 29.24,65.03 29.76,65.03 29.78,65.05 29.8,65.05 31.8,66.15 v38.8,66.05 | v47.1,65.45 47.29,65.64 IC1.54
  Bottom 0.2: v38.8,66.05 41.83,65.05 42.64,64.24 43.26,64.24 44.47,65.45 v47.1,65.45
D+  (via drill 0.5)
  Top 0.25: J1.D+ 9.63,84.27 7.08,84.27 5.76,85.59 5.76,86.91 7.12,88.27 7.12,88.92 7.15,88.96 7.15,94.3 8.4,95.55 48,95.55 74.85,75.4 74.9,63.5 71.2,63 v69.2,62.75 | IC1.36 52.74,61.25 54.17,61.68 54.62,65.16 54.81,65.36 56.79,67.31 57.58,67.96 59.28,67.97 62.21,67.84 65.99,66.04 66.11,65.11 66.01,63.81 v66.2,62
  Bottom 0.25: v69.2,62.75 67.15,62.25 v66.2,62
D-  (via drill 0.5)
  Top 0.25: v55,60.9 IC1.35
  Top 0.35: J1.D- 24.92,84.85 33.03,94.61 47.4,94.61 74,75.05 73.95,64.3 69.9,63.95 v68.7,63.8
  Bottom 0.35: v68.7,63.8 v55,60.9
DATO  (via drill 0.5)
  Top 0.15: IC1.39 51.72,62.82 | 4.35,76.88 4.3,76.88 2.37,78.81
  Top 0.25: 2.37,78.81 2.5,79.45 2.45,85.35 2.45,86.59 1.46,87.58 1.46,88.22 1.74,88.5 1.7,89.23 1.73,89.27 1.72,89.31 1.82,89.42 2.54,90.53 2.54,90.59 2.63,90.68 2.71,90.79 4.87,92.83 4.87,93.22 7.65,96 48.65,96 v64.28,84.88 | J5.7 5.54,65.36 6.06,65.36 6.25,65.55 6.25,66.62 4.35,68.53 4.35,76.88 | IC1.39 51.81,62.77 52.65,62.77 52.84,62.96 52.84,64.03 56.2,67.39 v56.2,70.4
  Bottom 0.25: v64.28,84.88 59.73,77.13 v56.2,70.4
GND  (via drill 0.35, 0.35 pad 1.3, 0.5)  (30 unrouted)
  Top 0.102: 42.86,57.15 42.79,57.23 IC1.18
  Top 0.15: J5.S3 1.32,65.9 J5.S4 | 9.75,79.55 J1.S4 | J1.S4 10.66,79.55 POWERJACK.3 POWERJACK.2 | J1.S4 J1.GND
  Top 0.203: CAP2.2 51.04,71.96 v51,72 | 43.09,75.21 v41.5,74.9 | CAP3.2 33.81,69.65 v31.9,69.05
  Top 0.25: v41.5,82.5 44.41,85.41 44.41,88.19 44.87,88.65 48.16,88.65 49.13,87.68 DEPTH_SENSOR.P$4 | J1.S1 4.35,88.85 v5.7,90.2 | v8.35,90.2 9.85,88.7 J1.S2 7.95,88.55 v7.9,88.6 | v6.55,78.55 8.75,78.55 9.6,79.4 | 9.6,79.4 9.75,79.55 | J1.S3 9.45,79.55 9.6,79.4 | VDDACAP1.1 34.14,57.99 VDDACAP2.1 32.23,57.38 v30.6,57.4 30.62,58.77 30.62,59.56 31.74,60.63 38,60.6 39.13,61.73 40.27,61.73 IC1.12 | C5.2 31.48,65.17 v31.34,65.03 | C10.2 v31.3,62.45
  Top 0.305: POWERJACK.2 15.47,70.97 15.5,71 v16,71 | J5.6 6.88,63.88 v7,64 | J5.S4 2.33,65.17 v2.5,65 | CAP7.2 39.73,54.77 v38.5,55 | CAP5.2 v55.8,60 | C7.2 51.4,56.1 v50.95,55.05 | J4.20 J4.4 2.42,14.72 2.5,14.64 2.5,13.5 3.5,12.5 v10,12.5
  Top 0.35: CAP4.2 43.09,75.21 | v58.35,59.95 58.3,62.8 CAP6.2
  Top 0.4: CANH_R.1 35.84,16.8 v35.75,16.8
  Bottom 0.2: 38.53,79.53 46.78,79.53 46.8,79.52 46.8,79.51 47,79.51 49.5,79.5
  Bottom 0.203: v51,72 51.1,77.9 49.5,79.5 | 38.4,79.53 36.2,79.45 30.25,70.85 | 24.26,3.45 23.91,5.08 | 24.26,3.45 U$1.GND1 | 24,3.71 24.26,3.45 | v41.5,74.9 39.35,79.55
  Bottom 0.25: v41.5,82.5 38.53,79.53 38.4,79.53 | v5.7,90.2 v8.35,90.2 | v7.9,88.6 7.14,87.84 6.69,87.84 5.35,86.5 5.35,79.75 v6.55,78.55 | v30.6,57.4 30.61,56.41 30.61,55 | v31.34,65.03 31.06,65.03 30.42,65.67 | 30.42,65.67 29.77,66.32 29.23,66.32 29,66.1 27.04,66.1 | v31.3,62.45 30.42,64.78 30.42,65.67
  Bottom 0.305: 27,3.17 U$1.GND1 | 27,3.17 U$1.GND3 | 8,65 v7,64 | 8,65 14,71 v16,71 30.25,70.85 28.88,68.11 | v2.5,65 8,65 | 28.88,68.11 27.04,66.1 26.5,65.5 26.62,51 | 26.96,7.5 26.92,13.2 26.84,22.65 26.62,51 | 26.96,7.5 27,3.17 | v31.9,69.05 28.99,68 28.88,68.11 | 33,55 v38.5,55 v50.95,55.05 | 26.62,51 30.61,55 33,55 | v58.35,59.95 57.45,58.4 53.25,58.52 36.5,58.5 33,55 | v10,12.5 18.46,12.5 26.96,7.5
  Bottom 0.35: 53.25,58.52 53.97,58.42 v55.8,60
  Bottom 0.4: 26.84,22.74 26.84,22.65 | v35.75,16.8 33.55,19 30.95,19 26.92,14.97 26.92,13.2
GNDBAT  (30 unrouted)
HEARTBEAT1  (1 unrouted)
HEARTBEAT2  (1 unrouted)
JTAG3
  Top 0.25: J4.3 6.35,17.83 5.27,18.92 5.27,19.82 6.09,20.64 5.27,21.46 5.27,22.36 5.9,22.99 6.79,22.99 36.62,53.22 36.62,55.39 37.52,56.3 39.25,56.5 44.34,62.22 46.23,64.56 46.27,68.39 46.27,69.23 IC1.56
JTAG5  (via drill 0.25)
  Top 0.25: J4.5 7.55,20.57 7.75,22.1 38,52.47 v38.5,53.5 | v48.9,53.65 49.65,55.05 50.62,55.8 50.78,57.3 50.73,66.04 50.93,66.23 51.77,66.23 IC1.46
  Bottom 0.25: v38.5,53.5 v48.9,53.65
JTAG9  (via drill 0.25)
  Top 0.25: J4.9 22,40.1 v22,47.5 | v22.45,68.24 24.11,70.7 38.47,76.35 40.91,79.44 | 48.34,79.34 v50.15,77.65 | IC1.49 49.77,69.27 49.77,70.11 49.77,70.5 49.86,71.61 v50.18,73.03
  Top 0.35: 40.91,79.44 48.34,79.34
  Bottom 0.25: 50.1,74.51 v50.18,73.03 | v22,47.5 v22.45,68.24
  Bottom 0.35: v50.15,77.65 50.1,74.51
JTAG13  (via drill 0.25)
  Top 0.25: v19.1,66.05 20.46,67.56 37.49,67.56 38.38,68.3 38.33,70.38 38.35,73.1 39.35,74 45.55,73.95 46.78,73.15 46.77,70.11 46.77,69.27 IC1.55
  Top 0.4: J4.13 19,42.18 v19,51
  Bottom 0.4: v19,51 v19.1,66.05
JTAG15  (via drill 0.35)  (1 unrouted)
  Top 0.15: RESET_SWITCH.1B RESET_SWITCH.1A
  Top 0.25: v27.51,64.68 27.94,64.25 IC1.7
  Top 0.254: IC1.7 40.27,64.27
  Top 0.305: J4.15 6.35,33.04 7.46,34.15 7.46,41.46 18.85,52.2 24,52.31 v27.44,55.77
  Bottom 0.305: v27.44,55.77 27.54,63.96 27.5,64 27.51,64.01 v27.51,64.68
N$1  (2 unrouted)
N$2  (1 unrouted)
N$4  (1 unrouted)
N$5  (1 unrouted)
N$6  (2 unrouted)
N$7  (1 unrouted)
N$8  (1 unrouted)
N$9  (1 unrouted)
N$10  (1 unrouted)
N$11  (1 unrouted)
N$12  (1 unrouted)
N$13  (1 unrouted)
N$14  (1 unrouted)
N$15  (1 unrouted)
N$16  (2 unrouted)
N$17  (1 unrouted)
N$18  (30 unrouted)
N$19  (1 unrouted)
N$22  (1 unrouted)
N$23  (2 unrouted)
N$24  (1 unrouted)
N$26  (1 unrouted)
N$28  (1 unrouted)
N$29  (1 unrouted)
N$30  (2 unrouted)
N$31  (1 unrouted)
N$33  (1 unrouted)
N$34  (1 unrouted)
N$36  (1 unrouted)
N$37  (2 unrouted)
N$38  (1 unrouted)
N$40  (1 unrouted)
N$43  (1 unrouted)
N$44  (2 unrouted)
N$45  (1 unrouted)
N$47  (1 unrouted)
N$50  (1 unrouted)
N$51  (2 unrouted)
N$52  (1 unrouted)
N$54  (1 unrouted)
N$57  (1 unrouted)
N$58  (2 unrouted)
N$59  (1 unrouted)
N$61  (1 unrouted)
N$64  (1 unrouted)
N$65  (2 unrouted)
N$66  (1 unrouted)
N$68  (1 unrouted)
N$71  (1 unrouted)
OI2  (1 unrouted)
OI3  (1 unrouted)
OI4  (1 unrouted)
OI5  (1 unrouted)
OI6  (1 unrouted)
OI7  (1 unrouted)
OI8  (1 unrouted)
OI10  (1 unrouted)
OIO9  (1 unrouted)
OSC1  (via drill 0.5)
  Top 0.25: OSCILLATOR.1 69.11,74.5 v69,72.25 | v42.95,65 42.7,64.75 40.4,64.75 | 40.4,64.75 IC1.6 | 40.4,64.75 40.38,64.77 39.43,64.77 35.72,64.78 C5.1
  Bottom 0.25: v69,72.25 67.65,68.4 56.4,68.55 54.2,66.55 44.5,66.55 v42.95,65
OSC2  (via drill 0.5)
  Top 0.25: v43.04,67.25 41.34,65.55 41.34,65.46 41.13,65.25 IC1.5 | OSCILLATOR.2 64.04,74.75 v64.05,73.15 | C10.1 36.16,62.4 v36.72,62.47
  Bottom 0.25: v64.05,73.15 61.76,69.11 55.81,69.11 | v43.04,67.25 42.26,67.25 41.16,67.26 39.12,67.28 38.48,66.83 38.22,66.62 37.62,66.18 37.63,64.92 37.63,63.12 v36.72,62.47
  Bottom 0.4: v43.04,67.25 53.95,67.25 55.81,69.11
P$2  (via drill 0.5)  (1 unrouted)
  Top 0.2: RI2C.1 32.55,51.69 37.29,56.93 39.06,56.93 43.8,62.37 43.8,68.6 43.74,68.4 43.74,69.2 IC1.61
  Top 0.35: v44.8,73.17 44.22,73.17 43.8,72.75
  Bottom 0.35: DEPTH_SENSOR.P$2 47,79.99 49.7,79.98 49.84,79.84 54.88,74.8 54.88,72.61 54.4,72.12 53.5,72.12 52.65,72.14 52.65,72 52.07,72 51.31,71.24 50.51,71.24 49.6,72.15 46.7,72.15 45.5,73.35 44.98,73.35 v44.8,73.17
PA15
  Top 0.25: J4.7 7.44,23 7.7,23 37.52,53.08 37.52,55.41 38.11,56 39.5,56 44.5,61.55 48.35,61.64 49.44,62.47 IC1.50
POWER  (2 unrouted)
PS$3  (via drill 0.25)
  Top 0.25: R12C.1 29.5,56.52 v29.55,57.47 | v29.5,65.66 31.45,67.05 | 31.45,67.05 31.9,67 37.77,67.05 38.88,68.06 38.84,69.69 38.89,72.95 39.5,73.51 42.25,73.5 43.29,72.61 IC1.62 | 31.45,67.05 20.98,66.95 19.42,65.34 18.73,65.34 18.34,65.73 18.34,66.27 20.86,68.8 21.87,68.8 23.53,71.21 23.57,71.22 23.59,71.26 37.1,76.35 44.87,84.12 44.87,88 45.06,88.2 47.37,88.2 47.88,87.68 DEPTH_SENSOR.P$3
  Bottom 0.25: v29.55,57.47 v29.5,65.66
RXD  (1 unrouted)
TXD  (1 unrouted)
VCAP_2TO1  (via drill 0.5)  (2 unrouted)
  Top 0.25: CAP5.1 55.75,65.14 v55.73,65.16 | v53.47,65.77 52.84,66.4 52.84,66.54 52.64,66.74 52.01,66.74 51.96,66.75 IC1.47
  Bottom 0.25: v55.73,65.16 54.08,65.16 v53.47,65.77